# Altium project PCB_Project_Node_2.PrjPcb
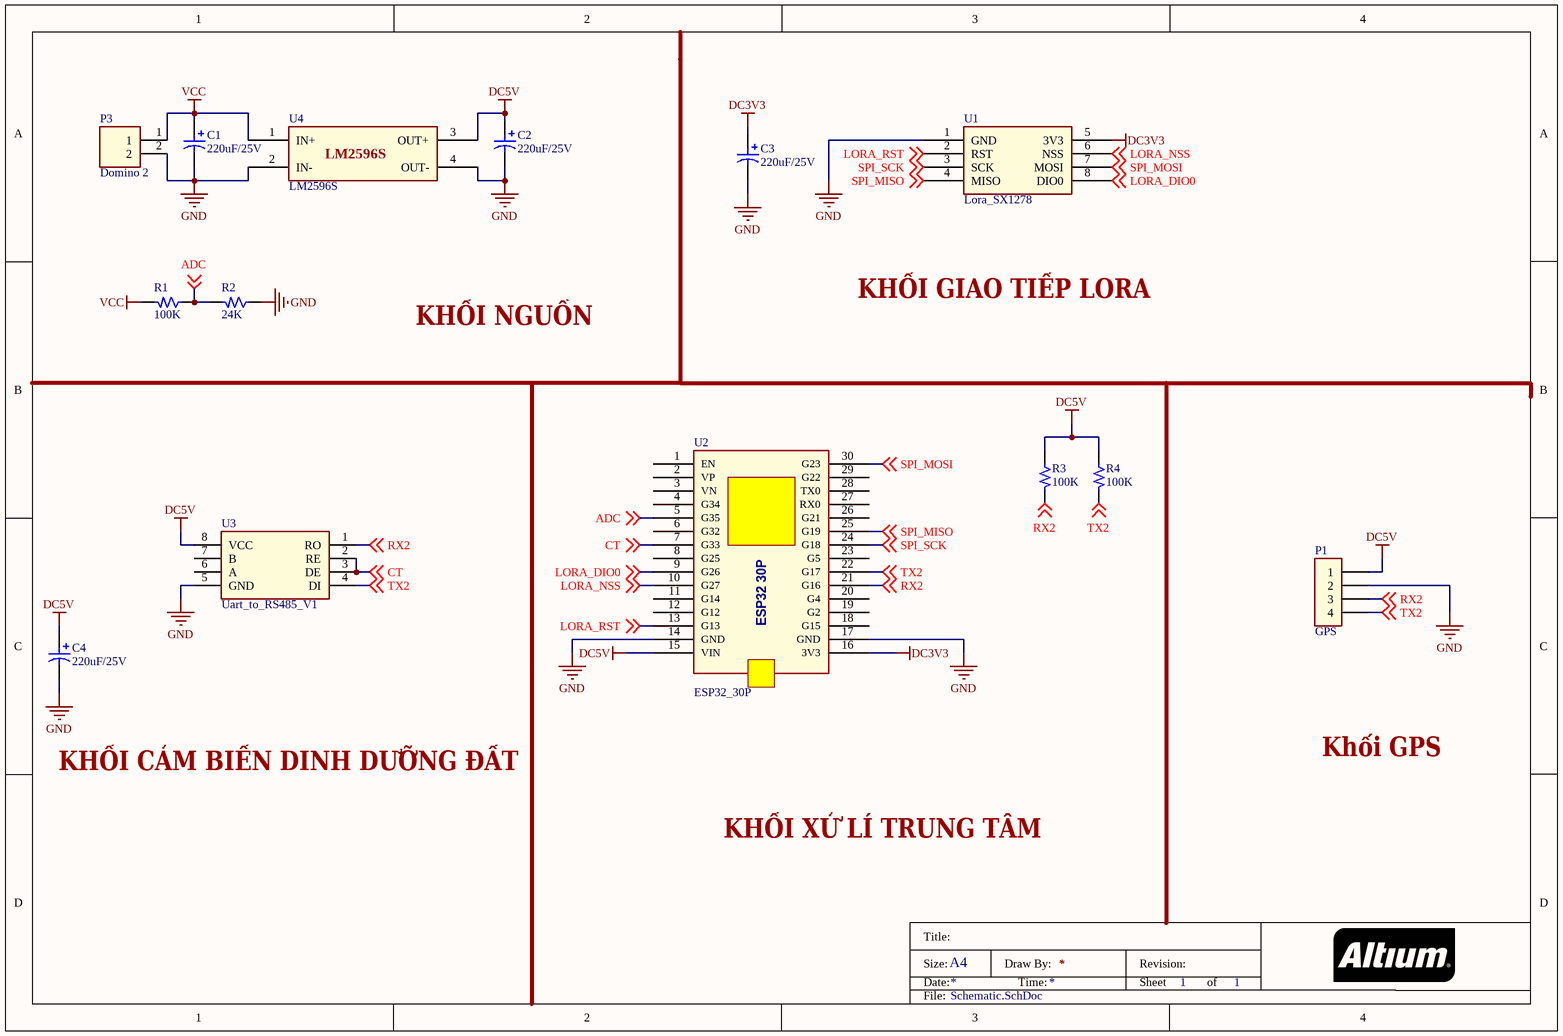
[diagram p0: Schematic.SchDoc]
1 sheet, 14 parts. Net scope: global (net labels, ports and power ports of the same name join across sheets).
Board file: PCB2.PcbDoc

## Sheet Schematic.SchDoc
size A4; Organization: Altium Limited; Address1: L3, 12a Rodborough Rd; Address2: Frenchs Forest; Address3: NSW; Address4: Australia 2086; SheetNumber: 1; SheetTotal: 1

### Parts
C1  220uF/25V  [CAP-ALUM-10x12.5]
C2  220uF/25V  [CAP-ALUM-10x12.5]
C3  220uF/25V  [CAP-ALUM-10x12.5]
C4  220uF/25V  [CAP-ALUM-10x12.5]
P1  GPS  [B4B-XH-A]
P3  Domino 2  [Domino-2]
R1  100K  [R1/4W-H1]
R2  24K  [R1/4W-H1]
R3  100K  [R1/4W-H1]
R4  100K  [R1/4W-H1]
U1  Lora_SX1278  [Module-LORA-SX1278]
U2  ESP32_30P  [Kit-ESP32-30P]
U3  Uart_to_RS485_V1  [Module-Uart-RS485-V1]
U4  LM2596S  [Module-LM2596S]

### Nets
DC3V3: C3.1 U1.5(3V3) U2.16(3V3)
DC5V: C2.1 C4.1 P1.1 R3.1 R4.1 U2.15(VIN) U3.8(VCC) U4.3(OUT+)
GND: C1.2 C2.2 C3.2 C4.2 P1.2 P3.2(2) R2.1 U1.1(GND) U2.14(GND) U2.17(GND) U3.5(GND) U4.2(IN-) U4.4(OUT-)
VCC: C1.1 P3.1(1) R1.2 U4.1(IN+)
ADC: R1.1 R2.2 U2.5(G35) ; off-sheet ADC
CT: U2.7(G33) U3.2(RE) U3.3(DE) ; off-sheet CT
LORA_DIO0: U1.8(DIO0) U2.9(G26) ; off-sheet LORA_DIO0
LORA_NSS: U1.6(NSS) U2.10(G27) ; off-sheet LORA_NSS
LORA_RST: U1.2(RST) U2.13(G13) ; off-sheet LORA_RST
RX2: P1.3 R3.2 U2.21(G16) U3.1(RO) ; off-sheet RX2
SPI_MISO: U1.4(MISO) U2.25(G19) ; off-sheet SPI_MISO
SPI_MOSI: U1.7(MOSI) U2.30(G23) ; off-sheet SPI_MOSI
SPI_SCK: U1.3(SCK) U2.24(G18) ; off-sheet SPI_SCK
TX2: P1.4 R4.2 U2.22(G17) U3.4(DI) ; off-sheet TX2

Not connected (* = marked no-connect by the designer): U2 1(EN) 2(VP) 3(VN) 4(G34) 6(G32) 8(G25) 11(G14) 12(G12) 18(G15) 19(G2) 20(G4) 23(G5) 26(G21) 27(RX0) 28(TX0) 29(G22); U3 6(A) 7(B)

### Notes on the sheet
- KHỐI NGUỒN
- KHỐI GIAO TIẾP LORA
- KHỐI CẢM BIẾN DINH DƯỠNG ĐẤT
- Khối GPS
- KHỐI XỬ LÍ TRUNG TÂM
- Title:
- Size:
- Date:
- A4
- Draw By:
- Time:
- Revision:
- Sheet
- of
- File:
- (in symbol Kit_ESP32_30P) ESP32 30P

### Library data of the parts
C1-C4 = EEUTA1E221: Capacitor Aluminum 220uF 20% 25V Radial; MPN: CLA4514; Solder: WAVE; Value: 220uF/25V; Category: CAPACITOR; MFR_URL: http://linhkienchatluong.vn/tu-hoa-chat-luong-cao/tu-hoa-63v-47uf-nipponlelon-8x11mm_sp977_ct6500.aspx; PinCount: 2
P1 = B4B-XH-A: Connector Header Through Hole 4 position 0.098" (2.50mm); Value: B4B-XH-A
P3 = Domino-2: Value: Domino 2
R1-R4 = RES-1/4W: Resistor 1/4W Through Hole
  R1 R3 R4: Value: 100K
  R2: Value: 24K
U1 = Module-Lora-SX1278-SPI: Module Lora SX1278 RA02 SPI; Value: Lora_SX1278
U2 = Kit_ESP32_30P: Kit ESP32 30P; Value: ESP32_30P
U3 = Module-Uart-to-RS485-V1: Module Uart to RS485 V1; Value: Uart_to_RS485_V1
U4 = Module-LM2596S: Module LM2596S; Value: LM2596S